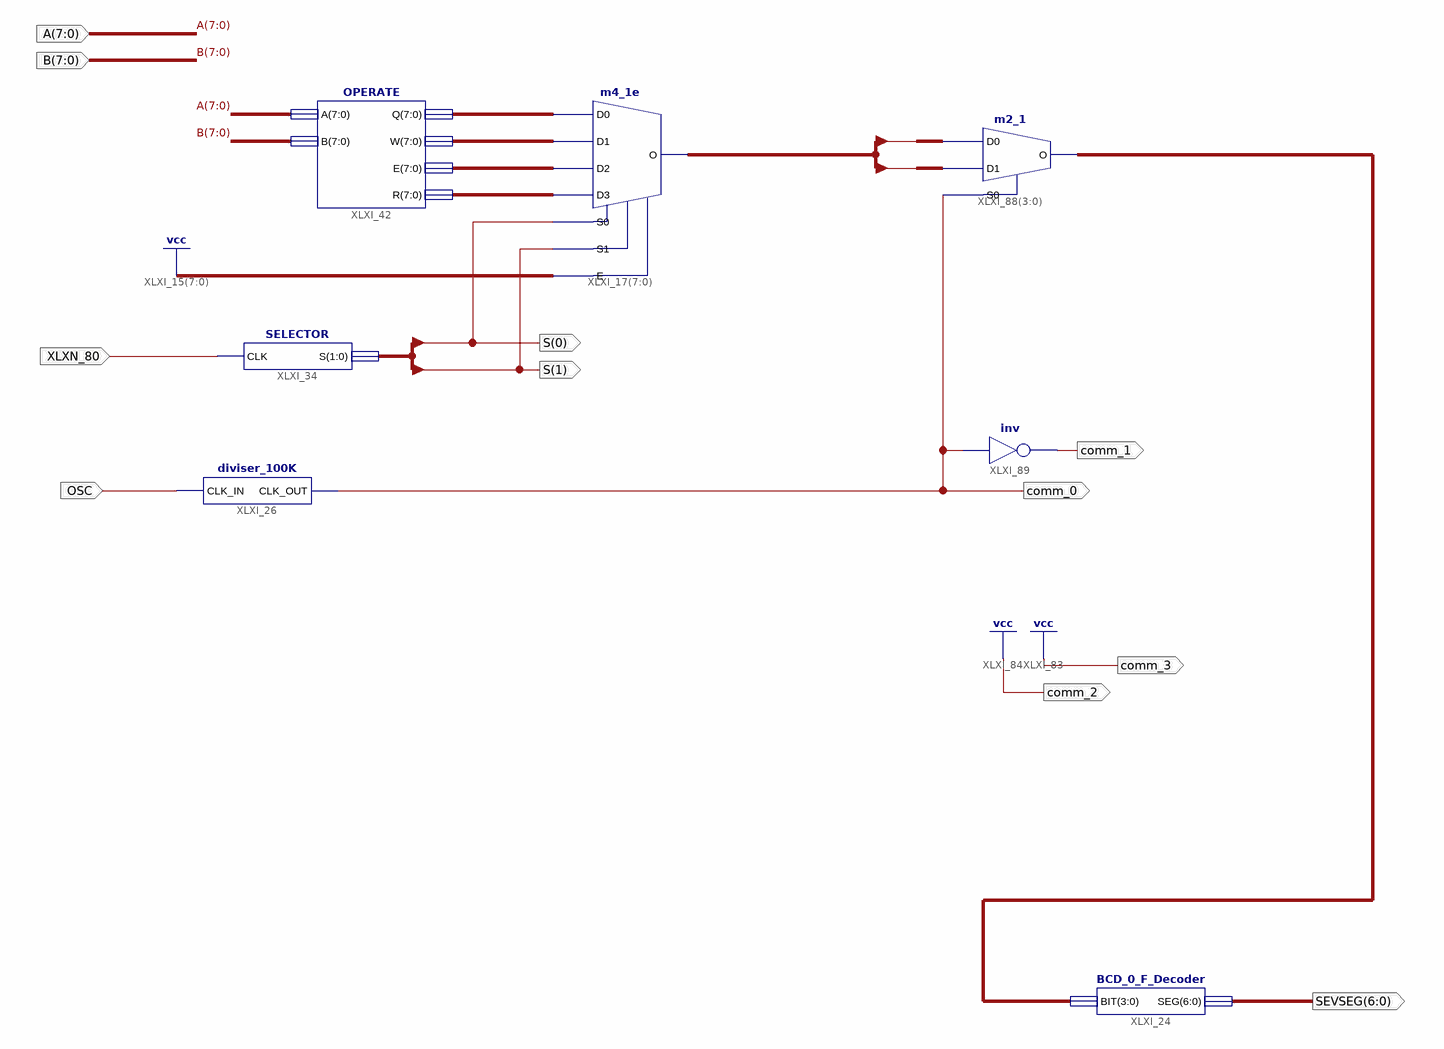
[diagram p0: schematic sheet 1]
// Xilinx ISE schematic ALU.sch (spartan6) as structural Verilog: 7 symbols, 11 ports
module ALU (
  input  XLXN_80,
  input  OSC,
  input  [7:0] A,
  input  [7:0] B,
  output [1:0] S,
  output comm_0,
  output comm_3,
  output [6:0] SEVSEG,
  output comm_2,
  output comm_1
);

  wire [3:0] XLXN_26;
  wire [7:0] DATA, XLXN_12, XLXN_13, XLXN_14, XLXN_89;

  OPERATE XLXI_42 (.A(A), .B(B), .E(XLXN_89), .Q(XLXN_12), .R(XLXN_14), .W(XLXN_13));
  m4_1e XLXI_17[7:0] (
    .D0(XLXN_12), .D1(XLXN_13), .D2(XLXN_89), .D3(XLXN_14), .E({8{1'b1}}), .S0(S[0]), .S1(S[1]), .O(DATA));
  SELECTOR XLXI_34 (.CLK(XLXN_80), .S(S));
  diviser_100K XLXI_26 (.CLK_IN(OSC), .CLK_OUT(comm_0));
  BCD_0_F_Decoder XLXI_24 (.BIT(XLXN_26), .SEG(SEVSEG));
  m2_1 XLXI_88[3:0] (.D0(DATA[3:0]), .D1(DATA[7:4]), .S0(comm_0), .O(XLXN_26));
  not XLXI_89 (comm_1, comm_0);

  assign comm_2 = 1'b1;
  assign comm_3 = 1'b1;

  // Notes on the sheet:
  //   LOC on signal S(0) = P82
  //   LOC on signal S(1) = P81
  //   LOC on signal XLXN_80 = P47
  //   CLOCK_DEDICATED_ROUTE on signal XLXN_80 = true
  //   LOC on signal comm_0 = P44
  //   LOC on signal OSC = P123
  //   LOC on signal comm_3 = P30
  //   LOC on signal comm_2 = P33
  //   LOC on signal comm_1 = P43
endmodule
